# Altium schematic sheet [04] - Keyboard Matrix 2.SchDoc: Keyboard Matrix 2
size A3; Date: N.A.; ApprovedBy: N.A.; CheckedBy: N.A.; Author: N.A.; CompanyName: Johannes Berndorfer; DrawnBy: JBE; Organization: N.A.; Address1: Konrad Grefe Gasse 22; Address2: 1230 Wien; Address3: AUSTRIA; Address4: N.A.; DocumentNumber: 4; Revision: A; SheetNumber: 4; SheetTotal: 8; ProjectTitle: Berndo Keyboard Switchboard PCB; Reviewer: -; Time: N.A.; ImagePath: N.A.; Application_BuildNumber: N.A.
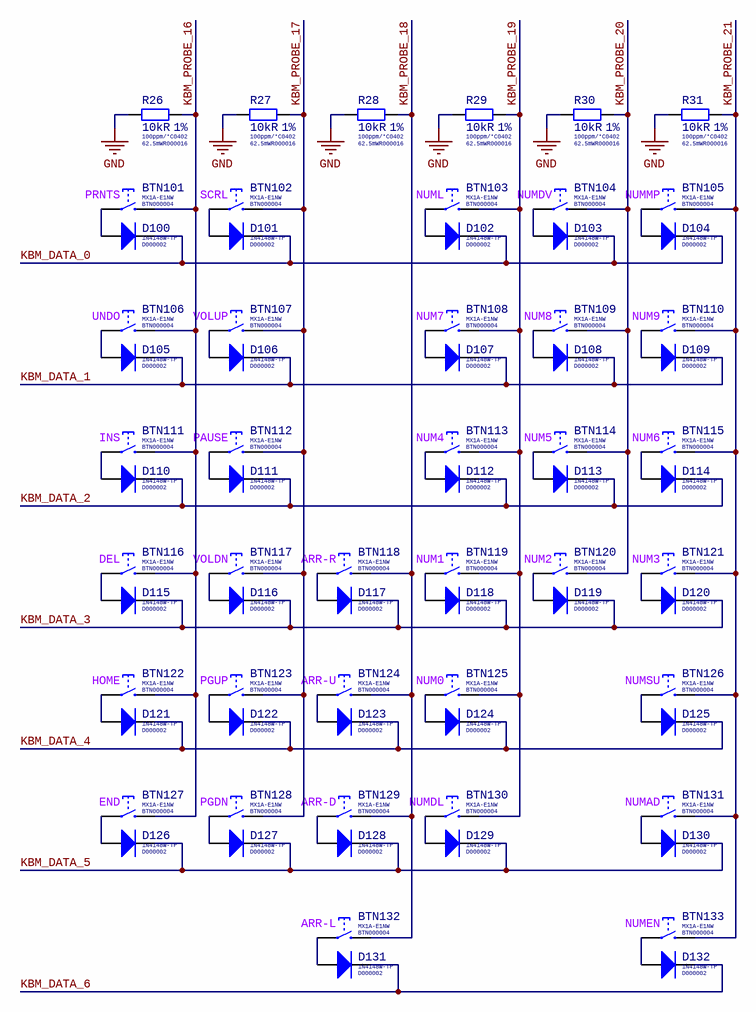
[diagram p0: [04] - Keyboard Matrix 2.SchDoc]

## Parts
BTN101  MX1A-E1NW  Internal Part Number: BTN000004  Key Function: PRNTS  [BTN-THT-MX-CHERRY]
BTN102  MX1A-E1NW  Internal Part Number: BTN000004  Key Function: SCRL  [BTN-THT-MX-CHERRY]
BTN103  MX1A-E1NW  Internal Part Number: BTN000004  Key Function: NUML  [BTN-THT-MX-CHERRY]
BTN104  MX1A-E1NW  Internal Part Number: BTN000004  Key Function: NUMDV  [BTN-THT-MX-CHERRY]
BTN105  MX1A-E1NW  Internal Part Number: BTN000004  Key Function: NUMMP  [BTN-THT-MX-CHERRY]
BTN106  MX1A-E1NW  Internal Part Number: BTN000004  Key Function: UNDO  [BTN-THT-MX-CHERRY]
BTN107  MX1A-E1NW  Internal Part Number: BTN000004  Key Function: VOLUP  [BTN-THT-MX-CHERRY]
BTN108  MX1A-E1NW  Internal Part Number: BTN000004  Key Function: NUM7  [BTN-THT-MX-CHERRY]
BTN109  MX1A-E1NW  Internal Part Number: BTN000004  Key Function: NUM8  [BTN-THT-MX-CHERRY]
BTN110  MX1A-E1NW  Internal Part Number: BTN000004  Key Function: NUM9  [BTN-THT-MX-CHERRY]
BTN111  MX1A-E1NW  Internal Part Number: BTN000004  Key Function: INS  [BTN-THT-MX-CHERRY]
BTN112  MX1A-E1NW  Internal Part Number: BTN000004  Key Function: PAUSE  [BTN-THT-MX-CHERRY]
BTN113  MX1A-E1NW  Internal Part Number: BTN000004  Key Function: NUM4  [BTN-THT-MX-CHERRY]
BTN114  MX1A-E1NW  Internal Part Number: BTN000004  Key Function: NUM5  [BTN-THT-MX-CHERRY]
BTN115  MX1A-E1NW  Internal Part Number: BTN000004  Key Function: NUM6  [BTN-THT-MX-CHERRY]
BTN116  MX1A-E1NW  Internal Part Number: BTN000004  Key Function: DEL  [BTN-THT-MX-CHERRY]
BTN117  MX1A-E1NW  Internal Part Number: BTN000004  Key Function: VOLDN  [BTN-THT-MX-CHERRY]
BTN118  MX1A-E1NW  Internal Part Number: BTN000004  Key Function: ARR-R  [BTN-THT-MX-CHERRY]
BTN119  MX1A-E1NW  Internal Part Number: BTN000004  Key Function: NUM1  [BTN-THT-MX-CHERRY]
BTN120  MX1A-E1NW  Internal Part Number: BTN000004  Key Function: NUM2  [BTN-THT-MX-CHERRY]
BTN121  MX1A-E1NW  Internal Part Number: BTN000004  Key Function: NUM3  [BTN-THT-MX-CHERRY]
BTN122  MX1A-E1NW  Internal Part Number: BTN000004  Key Function: HOME  [BTN-THT-MX-CHERRY]
BTN123  MX1A-E1NW  Internal Part Number: BTN000004  Key Function: PGUP  [BTN-THT-MX-CHERRY]
BTN124  MX1A-E1NW  Internal Part Number: BTN000004  Key Function: ARR-U  [BTN-THT-MX-CHERRY]
BTN125  MX1A-E1NW  Internal Part Number: BTN000004  Key Function: NUM0  [BTN-THT-MX-CHERRY]
BTN126  MX1A-E1NW  Internal Part Number: BTN000004  Key Function: NUMSU  [BTN-THT-MX-CHERRY]
BTN127  MX1A-E1NW  Internal Part Number: BTN000004  Key Function: END  [BTN-THT-MX-CHERRY]
BTN128  MX1A-E1NW  Internal Part Number: BTN000004  Key Function: PGDN  [BTN-THT-MX-CHERRY]
BTN129  MX1A-E1NW  Internal Part Number: BTN000004  Key Function: ARR-D  [BTN-THT-MX-CHERRY]
BTN130  MX1A-E1NW  Internal Part Number: BTN000004  Key Function: NUMDL  [BTN-THT-MX-CHERRY]
BTN131  MX1A-E1NW  Internal Part Number: BTN000004  Key Function: NUMAD  [BTN-THT-MX-CHERRY]
BTN132  MX1A-E1NW  Internal Part Number: BTN000004  Key Function: ARR-L  [BTN-THT-MX-CHERRY]
BTN133  MX1A-E1NW  Internal Part Number: BTN000004  Key Function: NUMEN  [BTN-THT-MX-CHERRY]
D100  1N4148W-TP  Internal Part Number: D000002  [D-SMD-SOD-123-MICRO-COMMERCIAL-COMPONENTS]
D101  1N4148W-TP  Internal Part Number: D000002  [D-SMD-SOD-123-MICRO-COMMERCIAL-COMPONENTS]
D102  1N4148W-TP  Internal Part Number: D000002  [D-SMD-SOD-123-MICRO-COMMERCIAL-COMPONENTS]
D103  1N4148W-TP  Internal Part Number: D000002  [D-SMD-SOD-123-MICRO-COMMERCIAL-COMPONENTS]
D104  1N4148W-TP  Internal Part Number: D000002  [D-SMD-SOD-123-MICRO-COMMERCIAL-COMPONENTS]
D105  1N4148W-TP  Internal Part Number: D000002  [D-SMD-SOD-123-MICRO-COMMERCIAL-COMPONENTS]
D106  1N4148W-TP  Internal Part Number: D000002  [D-SMD-SOD-123-MICRO-COMMERCIAL-COMPONENTS]
D107  1N4148W-TP  Internal Part Number: D000002  [D-SMD-SOD-123-MICRO-COMMERCIAL-COMPONENTS]
D108  1N4148W-TP  Internal Part Number: D000002  [D-SMD-SOD-123-MICRO-COMMERCIAL-COMPONENTS]
D109  1N4148W-TP  Internal Part Number: D000002  [D-SMD-SOD-123-MICRO-COMMERCIAL-COMPONENTS]
D110  1N4148W-TP  Internal Part Number: D000002  [D-SMD-SOD-123-MICRO-COMMERCIAL-COMPONENTS]
D111  1N4148W-TP  Internal Part Number: D000002  [D-SMD-SOD-123-MICRO-COMMERCIAL-COMPONENTS]
D112  1N4148W-TP  Internal Part Number: D000002  [D-SMD-SOD-123-MICRO-COMMERCIAL-COMPONENTS]
D113  1N4148W-TP  Internal Part Number: D000002  [D-SMD-SOD-123-MICRO-COMMERCIAL-COMPONENTS]
D114  1N4148W-TP  Internal Part Number: D000002  [D-SMD-SOD-123-MICRO-COMMERCIAL-COMPONENTS]
D115  1N4148W-TP  Internal Part Number: D000002  [D-SMD-SOD-123-MICRO-COMMERCIAL-COMPONENTS]
D116  1N4148W-TP  Internal Part Number: D000002  [D-SMD-SOD-123-MICRO-COMMERCIAL-COMPONENTS]
D117  1N4148W-TP  Internal Part Number: D000002  [D-SMD-SOD-123-MICRO-COMMERCIAL-COMPONENTS]
D118  1N4148W-TP  Internal Part Number: D000002  [D-SMD-SOD-123-MICRO-COMMERCIAL-COMPONENTS]
D119  1N4148W-TP  Internal Part Number: D000002  [D-SMD-SOD-123-MICRO-COMMERCIAL-COMPONENTS]
D120  1N4148W-TP  Internal Part Number: D000002  [D-SMD-SOD-123-MICRO-COMMERCIAL-COMPONENTS]
D121  1N4148W-TP  Internal Part Number: D000002  [D-SMD-SOD-123-MICRO-COMMERCIAL-COMPONENTS]
D122  1N4148W-TP  Internal Part Number: D000002  [D-SMD-SOD-123-MICRO-COMMERCIAL-COMPONENTS]
D123  1N4148W-TP  Internal Part Number: D000002  [D-SMD-SOD-123-MICRO-COMMERCIAL-COMPONENTS]
D124  1N4148W-TP  Internal Part Number: D000002  [D-SMD-SOD-123-MICRO-COMMERCIAL-COMPONENTS]
D125  1N4148W-TP  Internal Part Number: D000002  [D-SMD-SOD-123-MICRO-COMMERCIAL-COMPONENTS]
D126  1N4148W-TP  Internal Part Number: D000002  [D-SMD-SOD-123-MICRO-COMMERCIAL-COMPONENTS]
D127  1N4148W-TP  Internal Part Number: D000002  [D-SMD-SOD-123-MICRO-COMMERCIAL-COMPONENTS]
D128  1N4148W-TP  Internal Part Number: D000002  [D-SMD-SOD-123-MICRO-COMMERCIAL-COMPONENTS]
D129  1N4148W-TP  Internal Part Number: D000002  [D-SMD-SOD-123-MICRO-COMMERCIAL-COMPONENTS]
D130  1N4148W-TP  Internal Part Number: D000002  [D-SMD-SOD-123-MICRO-COMMERCIAL-COMPONENTS]
D131  1N4148W-TP  Internal Part Number: D000002  [D-SMD-SOD-123-MICRO-COMMERCIAL-COMPONENTS]
D132  1N4148W-TP  Internal Part Number: D000002  [D-SMD-SOD-123-MICRO-COMMERCIAL-COMPONENTS]
R26  Tolerance: 1%  Temperature Coefficient: 100ppm/°C  Resistance: 10kR  Power Rating: 62.5mW  Case Code (Imperial): 0402  Internal Part Number: R000016  [RES-SMD-0402-0.4MM-IPC-MED]  (hidden comment: 10kR 1%)
R27  Tolerance: 1%  Temperature Coefficient: 100ppm/°C  Resistance: 10kR  Power Rating: 62.5mW  Case Code (Imperial): 0402  Internal Part Number: R000016  [RES-SMD-0402-0.4MM-IPC-MED]  (hidden comment: 10kR 1%)
R28  Tolerance: 1%  Temperature Coefficient: 100ppm/°C  Resistance: 10kR  Power Rating: 62.5mW  Case Code (Imperial): 0402  Internal Part Number: R000016  [RES-SMD-0402-0.4MM-IPC-MED]  (hidden comment: 10kR 1%)
R29  Tolerance: 1%  Temperature Coefficient: 100ppm/°C  Resistance: 10kR  Power Rating: 62.5mW  Case Code (Imperial): 0402  Internal Part Number: R000016  [RES-SMD-0402-0.4MM-IPC-MED]  (hidden comment: 10kR 1%)
R30  Tolerance: 1%  Temperature Coefficient: 100ppm/°C  Resistance: 10kR  Power Rating: 62.5mW  Case Code (Imperial): 0402  Internal Part Number: R000016  [RES-SMD-0402-0.4MM-IPC-MED]  (hidden comment: 10kR 1%)
R31  Tolerance: 1%  Temperature Coefficient: 100ppm/°C  Resistance: 10kR  Power Rating: 62.5mW  Case Code (Imperial): 0402  Internal Part Number: R000016  [RES-SMD-0402-0.4MM-IPC-MED]  (hidden comment: 10kR 1%)

## Nets
GND: R26.1 R27.1 R28.1 R29.1 R30.1 R31.1
KBM_DATA_0: D100.1 D101.1 D102.1 D103.1 D104.1
KBM_DATA_1: D105.1 D106.1 D107.1 D108.1 D109.1
KBM_DATA_2: D110.1 D111.1 D112.1 D113.1 D114.1
KBM_DATA_3: D115.1 D116.1 D117.1 D118.1 D119.1 D120.1
KBM_DATA_4: D121.1 D122.1 D123.1 D124.1 D125.1
KBM_DATA_5: D126.1 D127.1 D128.1 D129.1 D130.1
KBM_DATA_6: D131.1 D132.1
KBM_PROBE_16: BTN101.2 BTN106.2 BTN111.2 BTN116.2 BTN122.2 BTN127.2 R26.2
KBM_PROBE_17: BTN102.2 BTN107.2 BTN112.2 BTN117.2 BTN123.2 BTN128.2 R27.2
KBM_PROBE_18: BTN118.2 BTN124.2 BTN129.2 BTN132.2 R28.2
KBM_PROBE_19: BTN103.2 BTN108.2 BTN113.2 BTN119.2 BTN125.2 BTN130.2 R29.2
KBM_PROBE_20: BTN104.2 BTN109.2 BTN114.2 BTN120.2 R30.2
KBM_PROBE_21: BTN105.2 BTN110.2 BTN115.2 BTN121.2 BTN126.2 BTN131.2 BTN133.2 R31.2
NetBTN101_1: BTN101.1 D100.2
NetBTN102_1: BTN102.1 D101.2
NetBTN103_1: BTN103.1 D102.2
NetBTN104_1: BTN104.1 D103.2
NetBTN105_1: BTN105.1 D104.2
NetBTN106_1: BTN106.1 D105.2
NetBTN107_1: BTN107.1 D106.2
NetBTN108_1: BTN108.1 D107.2
NetBTN109_1: BTN109.1 D108.2
NetBTN110_1: BTN110.1 D109.2
NetBTN111_1: BTN111.1 D110.2
NetBTN112_1: BTN112.1 D111.2
NetBTN113_1: BTN113.1 D112.2
NetBTN114_1: BTN114.1 D113.2
NetBTN115_1: BTN115.1 D114.2
NetBTN116_1: BTN116.1 D115.2
NetBTN117_1: BTN117.1 D116.2
NetBTN118_1: BTN118.1 D117.2
NetBTN119_1: BTN119.1 D118.2
NetBTN120_1: BTN120.1 D119.2
NetBTN121_1: BTN121.1 D120.2
NetBTN122_1: BTN122.1 D121.2
NetBTN123_1: BTN123.1 D122.2
NetBTN124_1: BTN124.1 D123.2
NetBTN125_1: BTN125.1 D124.2
NetBTN126_1: BTN126.1 D125.2
NetBTN127_1: BTN127.1 D126.2
NetBTN128_1: BTN128.1 D127.2
NetBTN129_1: BTN129.1 D128.2
NetBTN130_1: BTN130.1 D129.2
NetBTN131_1: BTN131.1 D130.2
NetBTN132_1: BTN132.1 D131.2
NetBTN133_1: BTN133.1 D132.2

## Notes on the sheet
- Title:
- Project:
- Document Nr.:
- Revision:
- Date:
- Drawn By:
- Time:
- Reviewed By:
- Sheet
- of
- Size:
- A3
- Variant:
- File:

## Library data of the parts
BTN101-BTN133 = MX1A-E1NW: BTN CHERRY MX BLUE SPST-NO 12V 10mA; Mechanical Life: 20000000Cycles; Throw Configuration: SPST; Contact Resistance: 200mR; Operating Force: 0.5N; Switch Function: Off-Mom; Row Spacing: 2.54mm; Actuator Length: 3.6mm; Supplier 1: Digi-Key; Manufacturer: Cherry; Manufacturer Part Number: MX1A-E1NW; Stock 1: 3965; Pricing 1: 1 = 0,90000, 10 = 0,84000, 25 = 0,80000, 50 = 0,76000, 100 = 0,74000, 250 = 0,72000, 500 = 0,68000, 1000 = 0,64000, 5000 = 0,54000 (USD); RoHS: Yes; Mount: Through Hole; Contact Plating: Gold; Contact Material: Gold,Silver; Number of Terminals: 2; Housing Material: Thermoplastic; Min Operating Temperature: -10°C; Max Operating Temperature: 70°C; Voltage Rating (AC): 12V; Voltage Rating (DC): 12V; Packaging: Bulk; Current Rating: 10mA; Max Voltage Rating (AC): 12V; Max Voltage Rating (DC): 12V; Max Current Rating: 10mA; Package Quantity: 1000; Termination: PC Pin; Electrical Life: 20000000Cycles; Orientation: Straight; Contact Current Rating: 10mA; Length: 15.6mm; Terminal Pitch: 6.35mm; Width: 15.6mm; Lead Free: Lead Free; Flammability Rating: UL94 HB; ComponentLink1URL: https://datasheet.ciiva.com/2869/mx20series-2869568.pdf?src-supplier=Digi-Key; ComponentLink1Description: https://datasheet.ciiva.com/2869/mx20series-2869568.pdf?src-supplier=Digi-Key; ComponentLink2URL: https://datasheet.ciiva.com/5259/mx-cat-216303-5259204.pdf?src-supplier=Mouser; ComponentLink2Description: https://datasheet.ciiva.com/5259/mx-cat-216303-5259204.pdf?src-supplier=Mouser; Supplier Part Number 1: CH197-ND
D100-D132 = 1N4148W-TP: DIODE GEN-PURP 100V 150mA 1V25@150mA SMD SOD-23; Manufacturer: MCC; Max Surge Current: 2A; Forward Voltage: 1V; Recovery Time: 4ns; Max Reverse Leakage Current: 5uA; Power Dissipation: 400mW; Max Forward Surge Current (Ifsm): 1A; Element Configuration: Single; Polarity: Standard; Capacitance: 4pF; Supplier 1: Digi-Key; Manufacturer Part Number: 1N4148W-TP; Stock 1: 1077433; Pricing 1: 1 = 0,13000, 10 = 0,11900, 100 = 0,06480, 500 = 0,03986, 1000 = 0,02718 (USD); RoHS: Yes; Mount: Surface Mount; Number of Pins: 2; Min Operating Temperature: -65°C; Max Operating Temperature: 150°C; Packaging: Tape and Reel; Forward Current: 150mA; Package Quantity: 3000; Average Rectified Current: 150mA; Reverse Recovery Time: 4ns; Max Repetitive Reverse Voltage (Vrrm): 100V; Peak Non-Repetitive Surge Current: 2A; Voltage Rating (DC): 100V; Current Rating: 150mA; Output Current: 150mA; Max Reverse Voltage (DC): 100V; Length: 2.85mm; Height: 1.2mm; Width: 1.8mm; Radiation Hardening: No; REACH SVHC: Unknown; Lead Free: Lead Free; ComponentLink1URL: https://datasheet.ciiva.com/1243/1684829-1243908.pdf?src-supplier=Newark; ComponentLink1Description: https://datasheet.ciiva.com/1243/1684829-1243908.pdf?src-supplier=Newark; ComponentLink2URL: https://datasheet.ciiva.com/16836/1n4148wsod123-16836277.pdf?src-supplier=Future+Electronics; ComponentLink2Description: https://datasheet.ciiva.com/16836/1n4148wsod123-16836277.pdf?src-supplier=Future+Electronics; ComponentLink3URL: https://datasheet.ciiva.com/4435/1n4148wsod123-48460-4435223.pdf?src-supplier=Mouser; ComponentLink3Description: https://datasheet.ciiva.com/4435/1n4148wsod123-48460-4435223.pdf?src-supplier=Mouser; ComponentLink4URL: https://datasheet.ciiva.com/14557/70055519-14557767.pdf?src-supplier=Allied+Electronics; ComponentLink4Description: https://datasheet.ciiva.com/14557/70055519-14557767.pdf?src-supplier=Allied+Electronics; ComponentLink5URL: https://datasheet.ciiva.com/911/1n4148wsod123-911676.pdf?src-supplier=Digi-Key; ComponentLink5Description: https://datasheet.ciiva.com/911/1n4148wsod123-911676.pdf?src-supplier=Digi-Key; ComponentLink6URL: https://datasheet.ciiva.com/7622/1684829-7622556.pdf?src-supplier=Element14; ComponentLink6Description: https://datasheet.ciiva.com/7622/1684829-7622556.pdf?src-supplier=Element14; ComponentLink7URL: https://datasheet.ciiva.com/911/1n4148wsod123-911677.pdf?src-supplier=Digi-Key; ComponentLink7Description: https://datasheet.ciiva.com/911/1n4148wsod123-911677.pdf?src-supplier=Digi-Key; ComponentLink8URL: https://datasheet.ciiva.com/911/1n4148wsod123-911678.pdf?src-supplier=Digi-Key; ComponentLink8Description: https://datasheet.ciiva.com/911/1n4148wsod123-911678.pdf?src-supplier=Digi-Key; ComponentLink9URL: https://datasheet.ciiva.com/22747/1684829-22747439.pdf?src-supplier=Element14; ComponentLink9Description: https://datasheet.ciiva.com/22747/1684829-22747439.pdf?src-supplier=Element14; Supplier Part Number 1: 1N4148WTPMSCT-ND
R26-R31 = RC0402FR-0710KL: RES 10K 1% 1/16W SMD 0402 YAEGO; Manufacturer: Yageo; Voltage Rating: 50V; Manufacturer Part Number: RC0402FR-0710KL; RoHS: Yes; Case/Package: 0402; Number of Pins: 2; Case Code (Metric): 1005; Min Operating Temperature: -55°C; Max Operating Temperature: 155°C; Packaging: Tape and Reel; Composition: Thick Film; Voltage Rating (DC): 50V; Termination: SMD/SMT; Military Standard: Not; Working Voltage: 50V; Number of Terminations: 2; Length: 1mm; Height: 0.32mm; Width: 0.5mm; Depth: 0.5mm; Lead Pitch: 0.2mm; REACH SVHC: No SVHC; Lead Free: Lead Free; ComponentLink1URL: https://datasheet.ciiva.com/7660/38568-7660787.pdf?src-supplier=Element14; ComponentLink1Description: https://datasheet.ciiva.com/7660/38568-7660787.pdf?src-supplier=Element14; ComponentLink2URL: https://datasheet.ciiva.com/7849/1784430-7849813.pdf?src-supplier=Element14; ComponentLink2Description: https://datasheet.ciiva.com/7849/1784430-7849813.pdf?src-supplier=Element14; ComponentLink3URL: https://datasheet.ciiva.com/7849/1686128-7849814.pdf?src-supplier=Element14; ComponentLink3Description: https://datasheet.ciiva.com/7849/1686128-7849814.pdf?src-supplier=Element14; ComponentLink4URL: https://datasheet.ciiva.com/7849/1784430-7849815.pdf?src-supplier=Element14; ComponentLink4Description: https://datasheet.ciiva.com/7849/1784430-7849815.pdf?src-supplier=Element14; ComponentLink5URL: https://datasheet.ciiva.com/22747/1018594-22747512.pdf?src-supplier=Element14; ComponentLink5Description: https://datasheet.ciiva.com/22747/1018594-22747512.pdf?src-supplier=Element14; ComponentLink6URL: https://datasheet.ciiva.com/12667/pyu-rc0402-51-rohs-l-6-r-12667067.pdf?src-supplier=Mouser; ComponentLink6Description: https://datasheet.ciiva.com/12667/pyu-rc0402-51-rohs-l-6-r-12667067.pdf?src-supplier=Mouser; ComponentLink7URL: https://datasheet.ciiva.com/7983/1018594-7983486.pdf?src-supplier=Element14; ComponentLink7Description: https://datasheet.ciiva.com/7983/1018594-7983486.pdf?src-supplier=Element14; Package Quantity: 10000; ComponentLink8URL: https://datasheet.ciiva.com/11819/0900766b80c66297-11819487.pdf?src-supplier=RSComponents; ComponentLink8Description: https://datasheet.ciiva.com/11819/0900766b80c66297-11819487.pdf?src-supplier=RSComponents; ComponentLink9URL: https://datasheet.ciiva.com/15189/getdatasheetpartid-329253-15189431.pdf?src-supplier=Verical; ComponentLink9Description: https://datasheet.ciiva.com/15189/getdatasheetpartid-329253-15189431.pdf?src-supplier=Verical; ComponentLink10URL: https://datasheet.ciiva.com/24070/pyu-rc0402-51-rohs-l-6-r-8721-24070077.pdf?src-supplier=Mouser; ComponentLink10Description: https://datasheet.ciiva.com/24070/pyu-rc0402-51-rohs-l-6-r-8721-24070077.pdf?src-supplier=Mouser; ComponentLink11URL: https://datasheet.ciiva.com/7849/1018594-7849966.pdf?src-supplier=Element14; ComponentLink11Description: https://datasheet.ciiva.com/7849/1018594-7849966.pdf?src-supplier=Element14; ComponentLink12URL: https://datasheet.ciiva.com/7849/1018594-7849967.pdf?src-supplier=Element14; ComponentLink12Description: https://datasheet.ciiva.com/7849/1018594-7849967.pdf?src-supplier=Element14; ComponentLink13URL: https://datasheet.ciiva.com/17070/pyu-rc0402-51-rohs-l-6-r-17070335.pdf?src-supplier=Future+Electronics; ComponentLink13Description: https://datasheet.ciiva.com/17070/pyu-rc0402-51-rohs-l-6-r-17070335.pdf?src-supplier=Future+Electronics; Supplier 1: Digi-Key; Stock 1: 86154015; Pricing 1: 1 = 0,10000, 10 = 0,01600, 100 = 0,00670, 1000 = 0,00301, 2500 = 0,00261, 5000 = 0,00215 (USD); Supplier Part Number 1: 311-10.0KLRCT-ND